# EAGLE schematic SnakeSchematic (EAGLE 7.5.0)
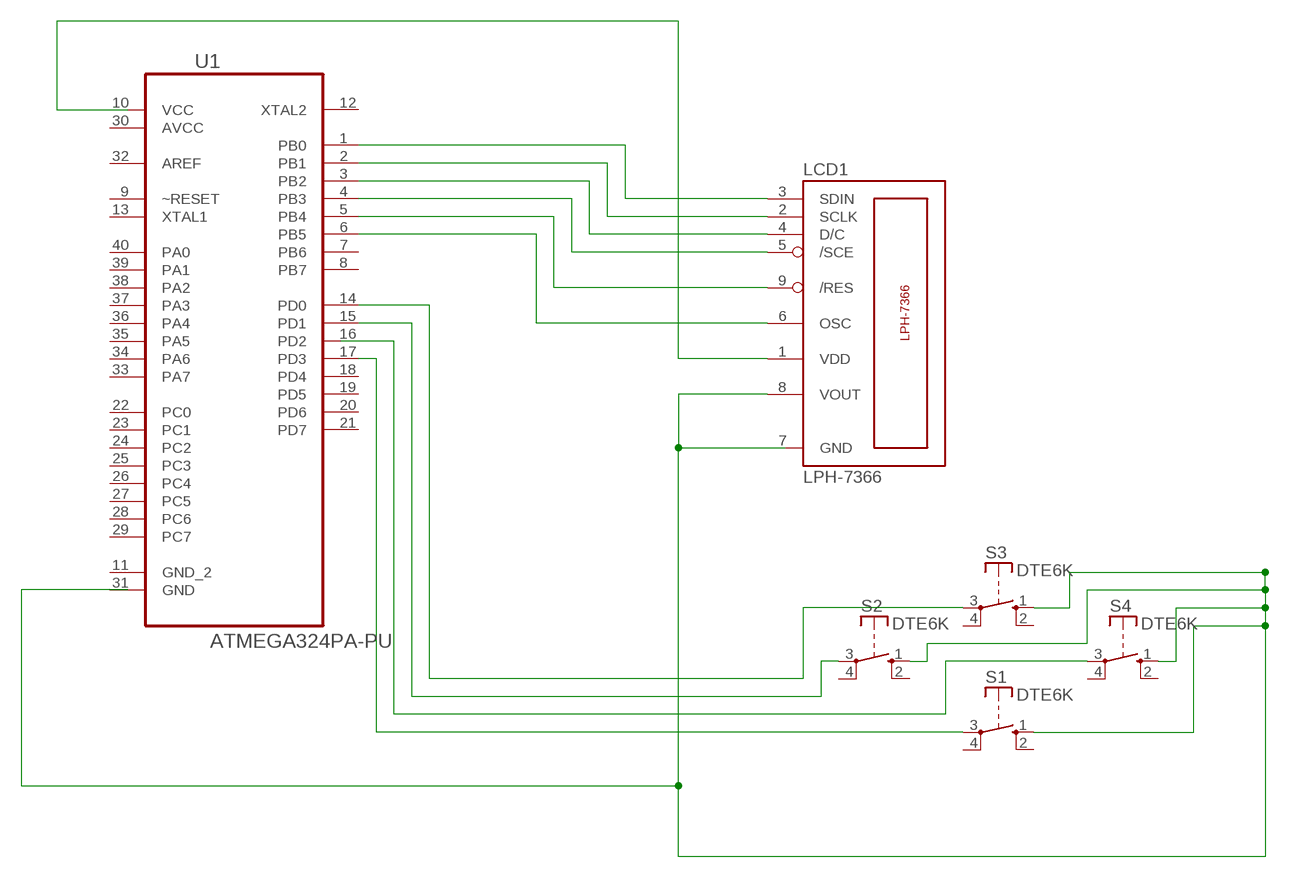
[diagram p0: schematic, sheet 1]

## Parts
LCD1  LPH-7366  [LPH-7366]
S1  DTE6K  [DTE6K]
S2  DTE6K  [DTE6K]
S3  DTE6K  [DTE6K]
S4  DTE6K  [DTE6K]
U1  ATMEGA324PA-PU  [DIP254P1524X482-40]

## Nets
N$1: LCD1.1(VDD)
N$2: LCD1.8(VOUT) S1.1(S) S2.1(S) S3.1(S) S4.1(S)
N$3: LCD1.3(SDIN) U1.1(PB0)
N$4: LCD1.2(SCLK) U1.2(PB1)
N$5: LCD1.4(D/C) U1.3(PB2)
N$6: LCD1.5(/SCE) U1.4(PB3)
N$7: LCD1.9(/RES) U1.5(PB4)
N$8: LCD1.6(OSC) U1.6(PB5)
N$9: S1.3(P) U1.17(PD3)
N$10: S2.3(P) U1.15(PD1)
N$11: S4.3(P)
N$12: S3.3(P) U1.14(PD0)
Unconnected: S1.2(S) S1.4(P) S2.2(S) S2.4(P) S3.2(S) S3.4(P) S4.2(S) S4.4(P) U1.7(PB6) U1.8(PB7) U1.9(~RESET) U1.11(GND_2) U1.12(XTAL2) U1.13(XTAL1) U1.16(PD2) U1.18(PD4) U1.19(PD5) U1.20(PD6) U1.21(PD7) U1.22(PC0) U1.23(PC1) U1.24(PC2) U1.25(PC3) U1.26(PC4) U1.27(PC5) U1.28(PC6) U1.29(PC7) U1.31(GND) U1.32(AREF) U1.33(PA7) U1.34(PA6) U1.35(PA5) U1.36(PA4) U1.37(PA3) U1.38(PA2) U1.39(PA1) U1.40(PA0)

## Power pins joined to a net without a drawn wire
AVCC: U1.30(AVCC)
GND: LCD1.7(GND)
VCC: U1.10(VCC)

## Library data of the parts
LCD1 = lph-7366:LPH-7366
S1-S4 = switch-misc:DT: ITT SWITCH
U1 = Atmel_By_element14_Batch_1-00:ATMEGA324PA-PU: 8-bit MCU; MPN: ATMEGA324PA-PU; OC_FARNELL: 1715485; OC_NEWARK: 15R0267; PACKAGE: DIP-40; SUPPLIER: ATMEL